# Altium project MB1419.PrjPcb
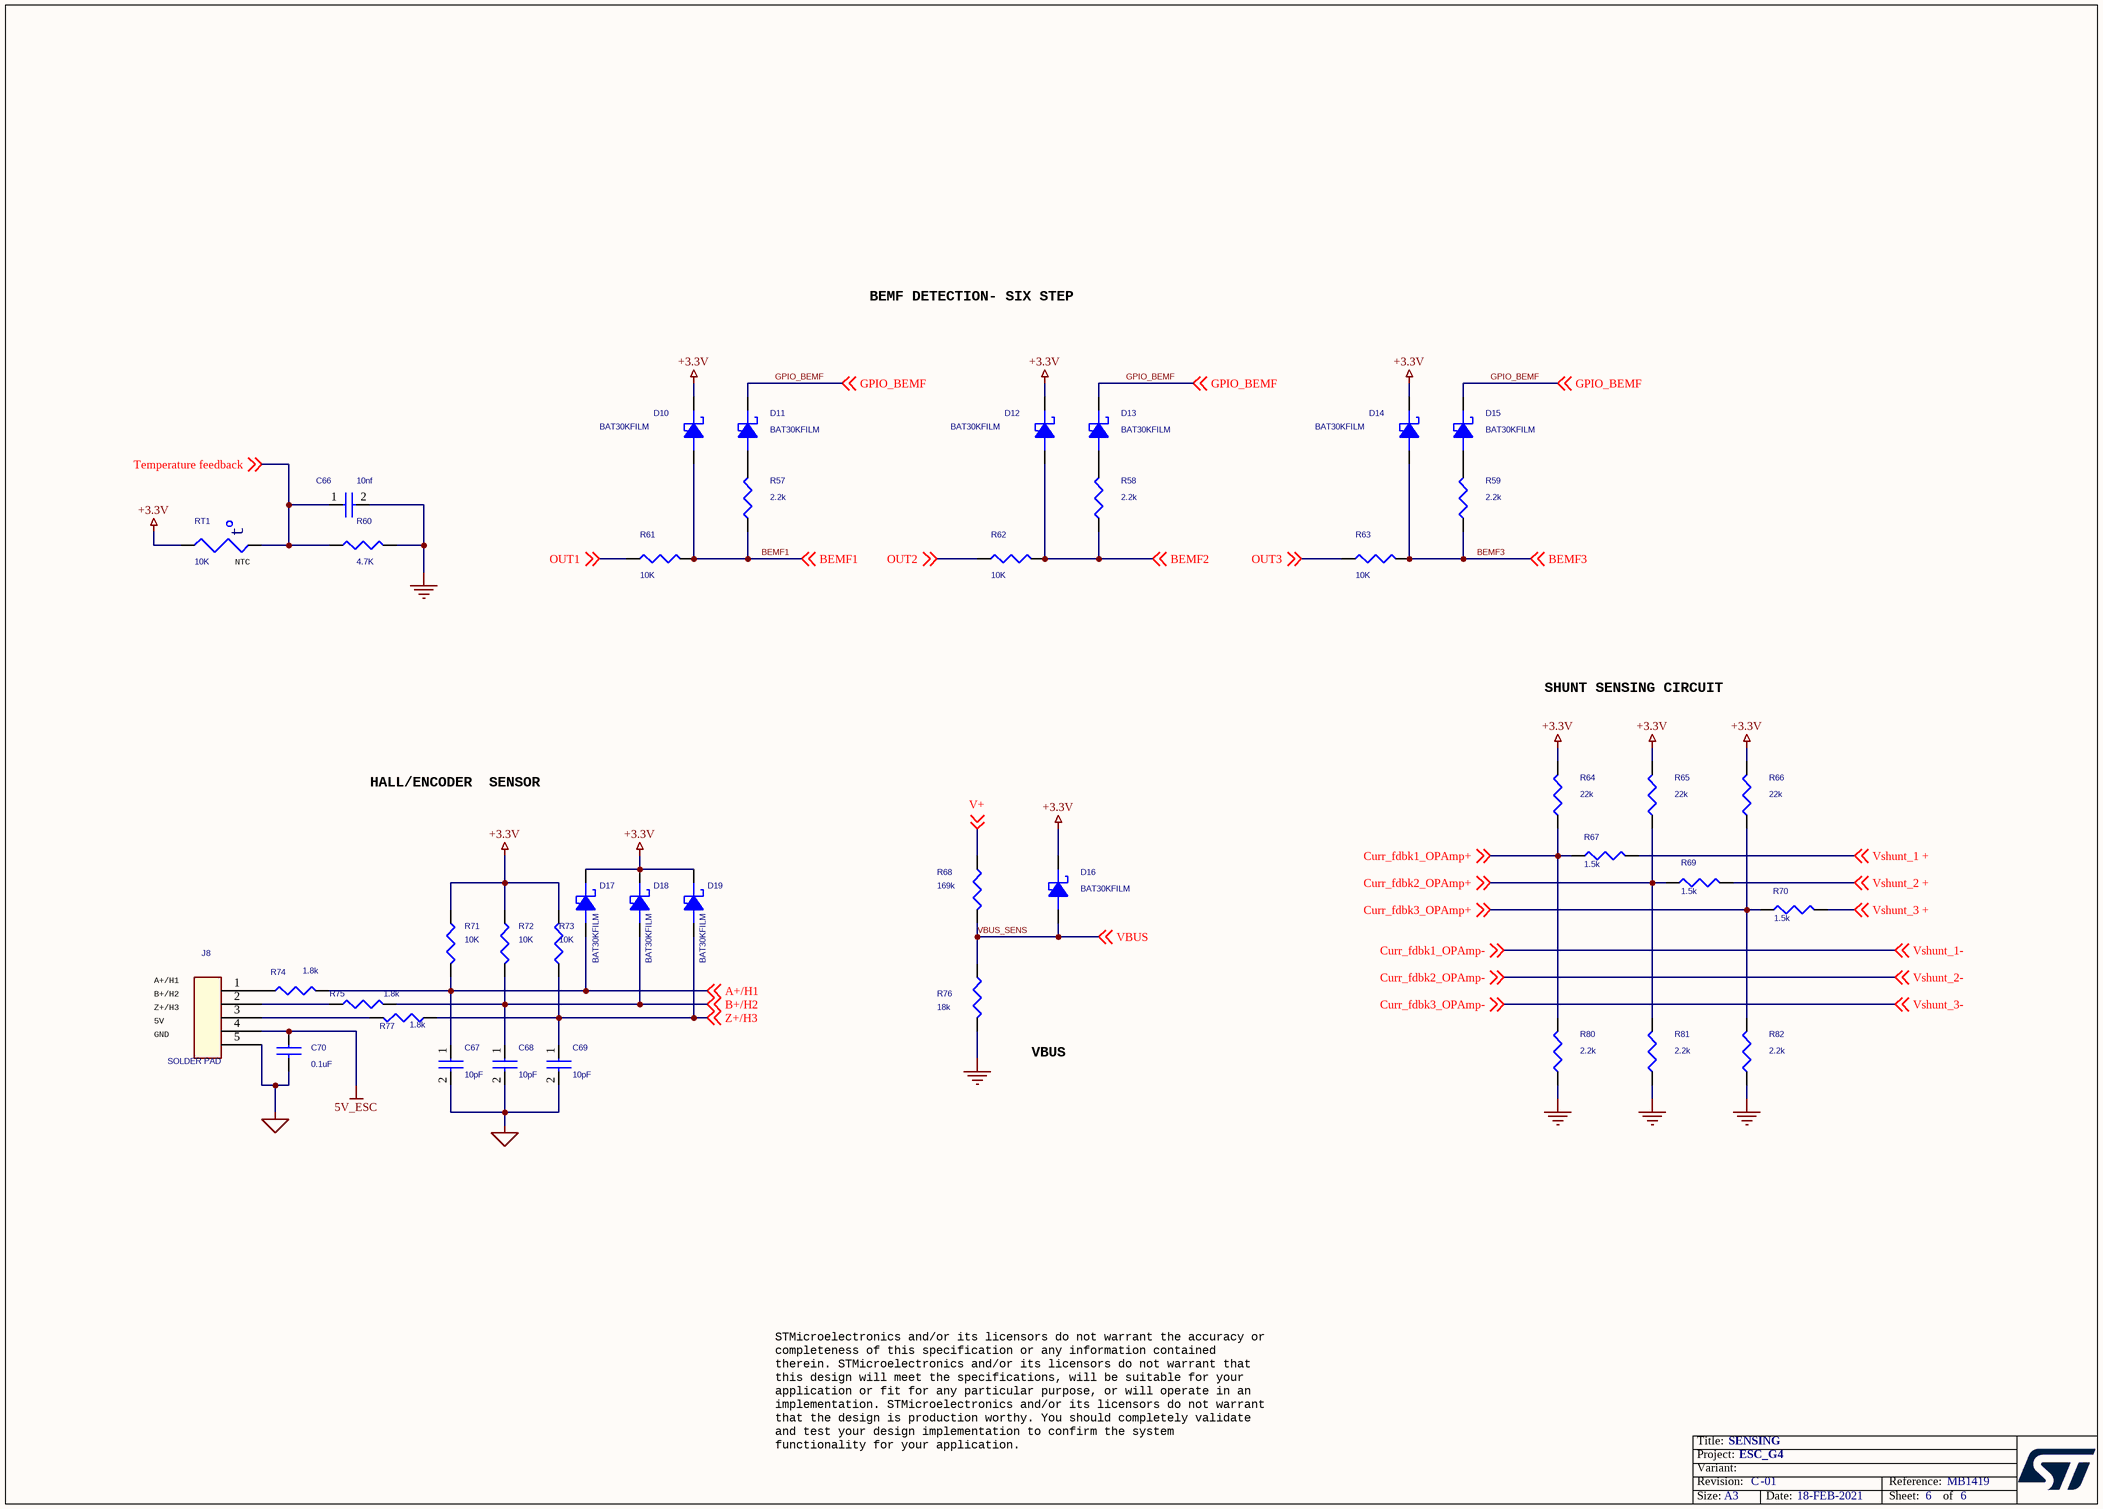
[diagram p0: SENSING.SchDoc]
Board_Assembly_Revision: 01; Board_Document_Date: 18-FEB-2021; Board_Name: ESC_G4; Board_PCB_Revision: C; Board_Reference: MB1419
1 sheet, 41 parts. Net scope: global (net labels, ports and power ports of the same name join across sheets).
Board file: MB1419.PcbDoc

## Sheet SENSING.SchDoc: SENSING
size A3; DocumentNumber: 6; SheetNumber: 6; SheetTotal: 6

### Parts
C66  10nf  [C_0402]
C67  10pF  [C_0402]
C68  10pF  [C_0402]
C69  10pF  [C_0402]
C70  0.1uF  [C_0402]
D10  BAT30KFILM  [sodfl160x80x65l30x30n]
D11  BAT30KFILM  [sodfl160x80x65l30x30n]
D12  BAT30KFILM  [sodfl160x80x65l30x30n]
D13  BAT30KFILM  [sodfl160x80x65l30x30n]
D14  BAT30KFILM  [sodfl160x80x65l30x30n]
D15  BAT30KFILM  [sodfl160x80x65l30x30n]
D16  BAT30KFILM  [sodfl160x80x65l30x30n]
D17  BAT30KFILM  [sodfl160x80x65l30x30n]
D18  BAT30KFILM  [sodfl160x80x65l30x30n]
D19  BAT30KFILM  [sodfl160x80x65l30x30n]
J8  SOLDER PAD  [SOLDER_PAD_5PIN_SMD]
R57  2.2k  [R_0402]
R58  2.2k  [R_0402]
R59  2.2k  [R_0402]
R60  4.7K  [R_0402]
R61  10K  [R_0603_HD]
R62  10K  [R_0603_HD]
R63  10K  [R_0603]
R64  22k  [r_0402]
R65  22k  [r_0402]
R66  22k  [r_0402]
R67  1.5k  [R_0402]
R68  169k  [R_0402]
R69  1.5k  [R_0402]
R70  1.5k  [R_0402]
R71  10K  [R_0402]
R72  10K  [R_0402]
R73  10K  [R_0402]
R74  1.8k  [R_0402]
R75  1.8k  [R_0402]
R76  18k  [R_0402]
R77  1.8k  [R_0402]
R80  2.2k  [R_0402]
R81  2.2k  [R_0402]
R82  2.2k  [R_0402]
RT1  10K  [R_0402]

### Nets
5V_ESC: C70.1 J8.4
+3.3V: D10.C D12.C D14.C D16.C D17.C D18.C D19.C R64.2 R65.2 R66.2 R71.1 R72.1 R73.2 RT1.1
GND: C66.2 R60.2 R76.2 R80.1 R81.1 R82.1
GND_SIGNAL: C67.2 C68.2 C69.2 C70.2 J8.5
A+/H1: C67.1 D17.A R71.2 R74.2 ; off-sheet A+/H1
B+/H2: C68.1 D18.A R72.2 R75.2 ; off-sheet B+/H2
BEMF1: D10.A R57.1 R61.2 ; off-sheet BEMF1
BEMF2: D12.A R58.1 R62.2 ; off-sheet BEMF2
BEMF3: D14.A R59.1 R63.2 ; off-sheet BEMF3
Curr_fdbk1_OPAmp+: R64.1 R67.1 R80.2 ; off-sheet Curr_fdbk1_OPAmp+
Curr_fdbk1_OPAmp-: off-sheet Curr_fdbk1_OPAmp-, off-sheet Vshunt_1-  [also labelled Vshunt_1-]
Curr_fdbk2_OPAmp+: R65.1 R69.1 R81.2 ; off-sheet Curr_fdbk2_OPAmp+
Curr_fdbk2_OPAmp-: off-sheet Curr_fdbk2_OPAmp-, off-sheet Vshunt_2-  [also labelled Vshunt_2-]
Curr_fdbk3_OPAmp+: R66.1 R70.1 R82.2 ; off-sheet Curr_fdbk3_OPAmp+
Curr_fdbk3_OPAmp-: off-sheet Curr_fdbk3_OPAmp-, off-sheet Vshunt_3-  [also labelled Vshunt_3-]
GPIO_BEMF: D11.C D13.C D15.C ; off-sheet GPIO_BEMF
OUT1: R61.1 ; off-sheet OUT1
OUT2: R62.1 ; off-sheet OUT2
OUT3: R63.1 ; off-sheet OUT3
Temperature feedback: C66.1 R60.1 RT1.2 ; off-sheet Temperature feedback
V+: R68.1 ; off-sheet V+
VBUS_SENS: D16.A R68.2 R76.1 ; off-sheet VBUS  [also labelled VBUS]
Vshunt_1 +: R67.2 ; off-sheet Vshunt_1 +
Vshunt_2 +: R69.2 ; off-sheet Vshunt_2 +
Vshunt_3 +: R70.2 ; off-sheet Vshunt_3 +
Z+/H3: C69.1 D19.A R73.1 R77.1 ; off-sheet Z+/H3
NetD11_A: D11.A R57.2
NetD13_A: D13.A R58.2
NetD15_A: D15.A R59.2
NetJ8_1: J8.1 R74.1
NetJ8_2: J8.2 R75.1
NetJ8_3: J8.3 R77.2

### Notes on the sheet
- BEMF DETECTION- SIX STEP
- (near RT1) NTC
- SHUNT SENSING CIRCUIT
- HALL/ENCODER  SENSOR
- (near J8) A+/H1
- 5V
- (near J8) Z+/H3
- (near J8) B+/H2
- GND
- VBUS
- STMicroelectronics and/or its licensors do not warrant the accuracy or
  completeness of this specification or any information contained
  therein. STMicroelectronics and/or its licensors do not warrant that
  this design will meet the specifications, will be suitable for your
  application or fit for any particular purpose, or will operate in an
  implementation. STMicroelectronics and/or its licensors do not warrant
  that the design is production worthy. You should completely validate
  and test your design implementation to confirm the system
  functionality for your application.
- Title:
- Project:
- Size:
- Revision:
- Variant:
- A3
- -
- Date:
- Reference:
- Sheet:
- of
- (in symbol NTC) t

### Library data of the parts
C66 = CAP_Dup1: CAP CER 10000PF 10V X7R 0402; PART_NUMBER: CAP-00000003; Manufacturer: Wurth Electronics Inc.; Manufacturer PN: 885012205012; Dielectric Type: Capacitors; Tolerance: 10%; CLASS: DISCRETE; Package Size: 0402 (1005 Metric); Temperature Coefficient: X7R; Rated Voltage: 10V
C67-C69 = CAP: CAP CER 10PF 10V C0G/NP0 0402; Manufacturer PN: 885012005007; Manufacturer: Wurth Electronics Inc.; PART_NUMBER: TMP-395; CLASS: DISCRETE; Tolerance: 5%; Temperature Coefficient: C0G, NP0; Dielectric Type: Capacitors; Rated Voltage: 10V; Package Size: 0402 (1005 Metric)
C70 = CAP_4: CAP CER 0.1UF 16V X7R 0402; Manufacturer PN: 885012205037; Manufacturer: Wurth Electronics Inc.; PART_NUMBER: CAP-00000053; CLASS: DISCRETE; Tolerance: 10%; Dielectric Type: Capacitors; Rated Voltage: 16V; Temperature Coefficient: X7R; Package Size: 0402 (1005 Metric)
D10 D17 D19 = DIODE_SCHOTTKY_0: DIODE SCHOTTKY 30V 300MA SOD523; Manufacturer: STMicroelectronics; PART_NUMBER: TMP-46; CLASS: DISCRETE; Rated Voltage: 530mV @ 300mA; Manufacturer PN: BAT30KFILM; Package Size: SC-79, SOD-523
D11-D16 D18 = DIODE_SCHOTTKY_0: DIODE SCHOTTKY 30V 300MA SOD523; PART_NUMBER: TMP-46; Manufacturer: STMicroelectronics; Rated Voltage: 530mV @ 300mA; CLASS: DISCRETE; Package Size: SC-79, SOD-523; Manufacturer PN: BAT30KFILM
J8 = CON5: SOLDER PADS
R57-R59 = RES: RES SMD 2.2K OHM 1% 1/16W 0402; Manufacturer PN: RC0402FR-072K2L; Manufacturer: Yageo; PART_NUMBER: TMP-444; CLASS: DISCRETE; Rated Power: 0.063W, 1/16W; Temperature Coefficient: 100ppm/C; Tolerance: 1%; Package Size: 0402 (1005 Metric)
R60 = RES: RES SMD 4.7K OHM 1% 1/16W 0402; PART_NUMBER: TMP-403; Manufacturer: TE Connectivity Passive Product; Manufacturer PN: CRG0402F4K7; Temperature Coefficient: 100ppm/C; Rated Power: 0.063W, 1/16W; CLASS: DISCRETE; Package Size: 0402 (1005 Metric); Tolerance: 1%
R61 R62 = RES: RES SMD 10K OHM 1% 1/10W 0603; PART_NUMBER: RES-00000015; Manufacturer: Yageo; Manufacturer PN: RC0603FR-0710KL; Temperature Coefficient: 100ppm/C; Rated Power: 0.1W, 1/10W; CLASS: DISCRETE; ALT_SYMBOLS: r_0603_hd; Package Size: 0603 (1608 Metric); Tolerance: 1%
R63 = RES: RES SMD 10K OHM 1% 1/10W 0603; PART_NUMBER: RES-00000015; Manufacturer: Yageo; Manufacturer PN: RC0603FR-0710KL; ALT_SYMBOLS: r_0603_hd; Temperature Coefficient: 100ppm/C; Rated Power: 0.1W, 1/10W; CLASS: DISCRETE; Package Size: 0603 (1608 Metric); Tolerance: 1%
R64-R66 = RES: RES SMD 22K OHM 1% 1/10W 0402; PART_NUMBER: TMP-751; Manufacturer: Panasonic Electronic Components; Manufacturer PN: ERJ-2RKF2202X; Temperature Coefficient: 100ppm/C; Rated Power: 0.1W, 1/10W; CLASS: DISCRETE; Package Size: 0402 (1005 Metric); Tolerance: 1%
R67 R69 R70 = RES: RES SMD 1.5K OHM 1% 1/16W 0402; PART_NUMBER: TMP-393; Manufacturer: Yageo; Manufacturer PN: RC0402FR-071K5L; Temperature Coefficient: 100ppm/C; Rated Power: 0.063W, 1/16W; CLASS: DISCRETE; Package Size: 0402 (1005 Metric); Tolerance: 1%
R68 = RES: RES SMD 169K OHM 1% 1/16W 0402; PART_NUMBER: TMP-424; Manufacturer: Yageo; Manufacturer PN: RC0402FR-07169KL; Temperature Coefficient: 100ppm/C; Rated Power: 0.063W, 1/16W; CLASS: DISCRETE; Package Size: 0402 (1005 Metric); Tolerance: 1%
R71 = RES: RES SMD 10K OHM 1% 1/16W 0402; PART_NUMBER: TMP-396; Manufacturer: Yageo; Manufacturer PN: RC0402FR-0710KL; Temperature Coefficient: 100ppm/C; Rated Power: 0.063W, 1/16W; CLASS: DISCRETE; Package Size: 0402 (1005 Metric); Tolerance: 1%
R72 R73 = RES: RES SMD 10K OHM 1% 1/16W 0402; Manufacturer PN: RC0402FR-0710KL; Manufacturer: Yageo; PART_NUMBER: TMP-396; CLASS: DISCRETE; Rated Power: 0.063W, 1/16W; Temperature Coefficient: 100ppm/C; Tolerance: 1%; Package Size: 0402 (1005 Metric)
R74 = RES: RES SMD 1.8K OHM 1% 1/16W 0402; Manufacturer PN: RC0402FR-071K8L; Manufacturer: Yageo; PART_NUMBER: TMP-394; CLASS: DISCRETE; Rated Power: 0.063W, 1/16W; Temperature Coefficient: 100ppm/C; Tolerance: 1%; Package Size: 0402 (1005 Metric)
R75 R77 = RES: RES SMD 1.8K OHM 1% 1/16W 0402; PART_NUMBER: TMP-394; Manufacturer: Yageo; Manufacturer PN: RC0402FR-071K8L; Temperature Coefficient: 100ppm/C; Rated Power: 0.063W, 1/16W; CLASS: DISCRETE; Package Size: 0402 (1005 Metric); Tolerance: 1%
R76 = RES: RES SMD 18K OHM 1% 1/16W 0402; PART_NUMBER: TMP-425; Manufacturer: Yageo; Manufacturer PN: RC0402FR-0718KL; Temperature Coefficient: 100ppm/C; Rated Power: 0.063W, 1/16W; CLASS: DISCRETE; Package Size: 0402 (1005 Metric); Tolerance: 1%
R80-R82 = RES: RES SMD 2.2K OHM 1% 1/16W 0402; PART_NUMBER: TMP-444; Manufacturer: Yageo; Manufacturer PN: RC0402FR-072K2L; Temperature Coefficient: 100ppm/C; Rated Power: 0.063W, 1/16W; CLASS: DISCRETE; Package Size: 0402 (1005 Metric); Tolerance: 1%
RT1 = NTC: NTC THERMISTOR 10K OHM 1% 0402; Manufacturer PN: NTCG103JF103FT1; Manufacturer: TDK Corporation; PART_NUMBER: TMP-423; CLASS: DISCRETE; Package Size: 0402 (1005 Metric)

## Assembly variants
G431CBU6: not fitted C12 J1 J2 J3 J4 J5 J6 J7 J8 JP1 JP2 JP3 R17 TP1 TP2 TP3